# Altium project UZ_D_DSUB_Breakout.PrjPCB
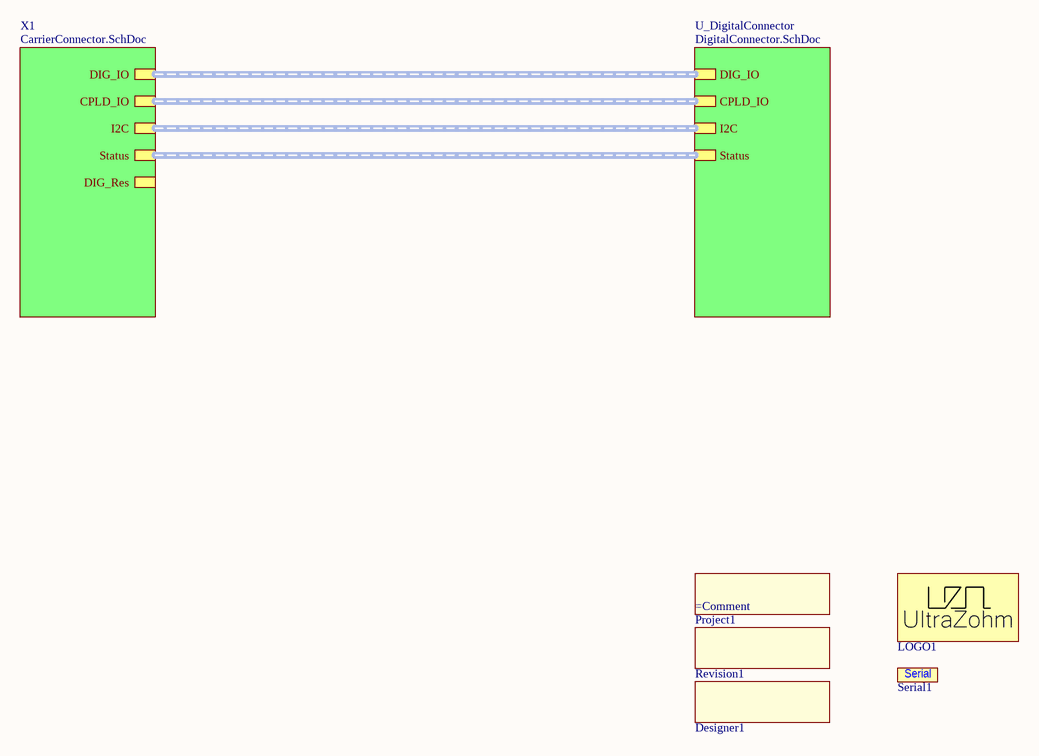
[diagram p0: TopSheet.SchDoc]
ProjectRevision: Rev01; ProjectNameCustom: =ProjectName; ProjectName: UZ_D_DSUB_Breakout; Date: 12/2022; AuthorParam: Andreas Geiger; Author: Andreas Geiger
3 sheets, 7 parts. Net scope: hierarchical (ports join the sheet entries above them; power ports are global).
Board file: UZ_D_DSUB_Breakout.PcbDoc
Sheets:
  TopSheet.SchDoc
    X1 = CarrierConnector.SchDoc
    U_DigitalConnector = DigitalConnector.SchDoc

## Sheet TopSheet.SchDoc
size A4; Author: Andreas Geiger; CompanyName: Technische Hochschule Nürnberg Georg Simon Ohm; Organization: UltraZohm; Address1: Kesslerplatz 12; Address2: 90489 Nürnberg; Address3: GERMANY; DocumentNumber: 1; SheetNumber: 1; SheetTotal: 3; Website: www.ultrazohm.com

### Parts
Designer1  (no value)  [Designator:comment]  (no BOM)
LOGO1  UZ Logo  [UZ_Logo_medium]  (value not drawn)  (no BOM)
Project1  (no value)  [COMMENT]  (no BOM)
Revision1  (no value)  [Designator:comment]  (no BOM)
Serial1  Serial #  [SERIAL]  (value not drawn)  (no BOM)

### Sub-sheets
U_DigitalConnector = DigitalConnector.SchDoc: I2C (harness DigCon_I2C), Status (harness DigCon_Status), CPLD_IO (harness DigCon_DCPLD_IO), DIG_IO (harness DigCon_DIG_IO)
X1 = CarrierConnector.SchDoc: DIG_IO (harness DigCon_DIG_IO), DIG_Res (harness DigCon_DIG_Res), CPLD_IO (harness DigCon_DCPLD_IO), Status (harness DigCon_Status), I2C (harness DigCon_I2C)

### Buses and harness runs
harness sheet U_DigitalConnector/CPLD_IO = sheet X1/CPLD_IO
harness sheet U_DigitalConnector/DIG_IO = sheet X1/DIG_IO
harness sheet U_DigitalConnector/I2C = sheet X1/I2C
harness sheet U_DigitalConnector/Status = sheet X1/Status

### Notes on the sheet
- Title
- Revision:
- Design Engineer:
- Date:
- Project:
- Sheet
- of
- (in symbol 6) Serial

### Library data of the parts
Designer1 = 4: Create a project parameter named "Author" this is the value of this component. It is printed on the PCB. Once the parameter is updated (e.g. new revision) it gets updated on the PCB as well; Manufacturer: PCB Manufacturer; Manufacturer Part Number: Project Author; Value: Andreas Geiger; Created from: T. Wendt; PartID: 4; Created On: 01.03.2021 08:53:41; Component Type: Project Author; Last Updated: 01.03.2021 09:20:27; Type: Standard (No BOM); Live Cycle Status: 1
LOGO1 = 1: Official Project Logo of the UltraZohm; Manufacturer: PCB Manufacturer; Manufacturer Part Number: UltraZohm Logo; Created from: T. Wendt; PartID: 1; Created On: 19.02.2021 16:55:56; ComponentLink1Description: Homepage; ComponentLink1URL: https://ultrazohm.com; Component Type: Logo; Last Updated: 02.03.2021 14:31:24; Type: Standard (No BOM); Live Cycle Status: 1
Project1 = 2: Create a project parameter named "ProjectNameCustom" this is the value of this component and it is printed on the PCB.; Manufacturer: PCB Manufacturer; Created from: T. Wendt; PartID: 2; Created On: 01.03.2021 08:43:57; Component Type: Project Name; Last Updated: 01.03.2021 09:07:27; Manufacturer Part Number: Project Name; Type: Standard (No BOM); Value: =ProjectName; Live Cycle Status: 1
Revision1 = 3: Create a project parameter named "ProjectRevision" this is the value of this component. It is printed on the PCB. Once the parameter is updated (e.g. new revision) it gets updated on the PCB as well; Manufacturer: PCB Manufacturer; Value: Rev01; Created from: T. Wendt; PartID: 3; Created On: 01.03.2021 08:50:34; Component Type: Project Revision; Last Updated: 01.03.2021 09:28:36; Manufacturer Part Number: Project Revision; Type: Standard (No BOM); Live Cycle Status: 1
Serial1 = 6: Field to put in a serial number; Manufacturer: PCB Manufacturer; Created from: T. Wendt; PartID: 6; Created On: 02.03.2021 14:31:24; Component Type: Serial Number; Last Updated: 02.03.2021 14:31:24; Manufacturer Part Number: Serial Number; Type: Standard (No BOM); Live Cycle Status: 1

## Sheet CarrierConnector.SchDoc
size A4; Author: Andreas Geiger; CompanyName: Technische Hochschule Nürnberg Georg Simon Ohm; Organization: UltraZohm; Address1: Kesslerplatz 12; Address2: 90489 Nürnberg; Address3: GERMANY; DocumentNumber: 2; SheetNumber: 1; SheetTotal: 2; Website: www.ultrazohm.com
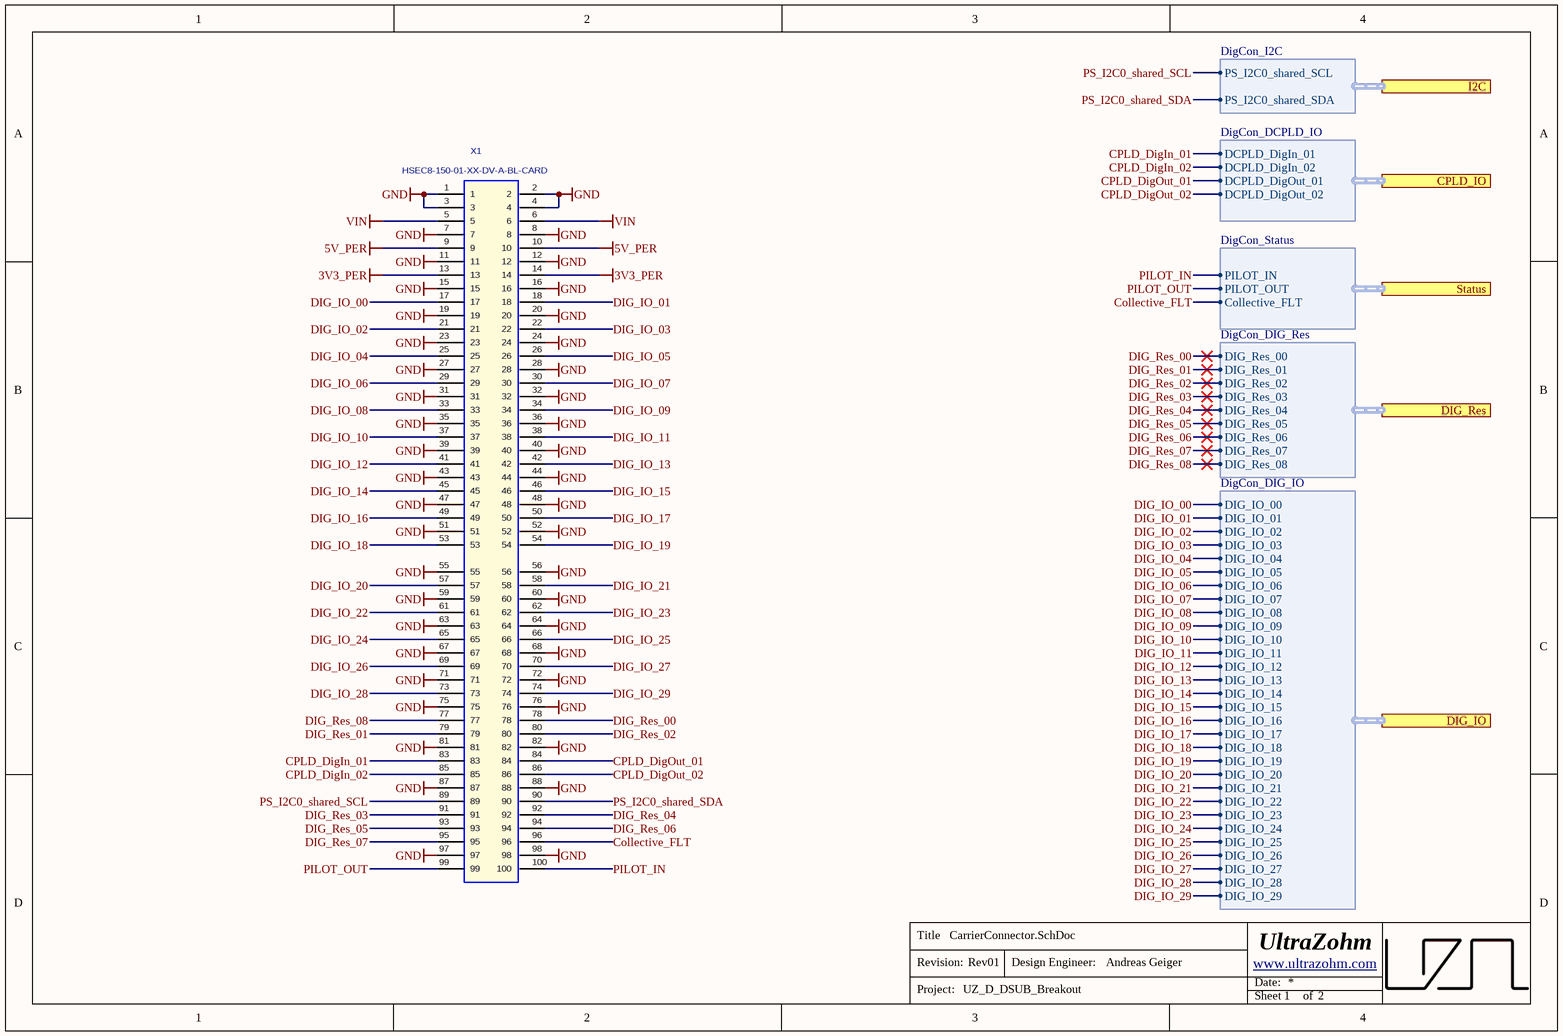
[diagram p1: CarrierConnector.SchDoc]

### Parts
X1  HSEC8-150-01-XX-DV-A-BL-CARD  [HSEC8-150-01-XX-DV-A-BL-CARD]  (no BOM)

### Ports
CPLD_IO (harness DigCon_DCPLD_IO, see TopSheet[2B], DigitalConnector[4A]), DIG_IO (harness DigCon_DIG_IO, see TopSheet[2A], DigitalConnector[4C]), DIG_Res (harness DigCon_DIG_Res, see TopSheet[2B]), I2C (harness DigCon_I2C, see TopSheet[2B], DigitalConnector[4A]), Status (harness DigCon_Status, see TopSheet[2B], DigitalConnector[4B])

### Harnesses
DigCon_I2C: PS_I2C0_shared_SDA, PS_I2C0_shared_SCL
DigCon_Status: PILOT_IN, PILOT_OUT, Collective_FLT
DigCon_DCPLD_IO: DCPLD_DigIn_01, DCPLD_DigIn_02, DCPLD_DigOut_01, DCPLD_DigOut_02
DigCon_DIG_IO: DIG_IO_01, DIG_IO_02, DIG_IO_03, DIG_IO_04, DIG_IO_05, DIG_IO_06, DIG_IO_07, DIG_IO_08, DIG_IO_09, DIG_IO_10, DIG_IO_11, DIG_IO_12, DIG_IO_13, DIG_IO_14, DIG_IO_15, DIG_IO_16, DIG_IO_17, DIG_IO_18, DIG_IO_19, DIG_IO_20, DIG_IO_21, DIG_IO_22, DIG_IO_23, DIG_IO_24, DIG_IO_25, DIG_IO_26, DIG_IO_27, DIG_IO_28, DIG_IO_29, DIG_IO_00
DigCon_DIG_Res: DIG_Res_01, DIG_Res_02, DIG_Res_03, DIG_Res_04, DIG_Res_05, DIG_Res_06, DIG_Res_07, DIG_Res_00, DIG_Res_08

### Nets
3V3_PER: X1.13 X1.14
5V_PER: X1.9 X1.10
GND: X1.1 X1.2 X1.3 X1.4 X1.7 X1.8 X1.11 X1.12 X1.15 X1.16 X1.19 X1.20 X1.23 X1.24 X1.27 X1.28 X1.31 X1.32 X1.35 X1.36 X1.39 X1.40 X1.43 X1.44 X1.47 X1.48 X1.51 X1.52 X1.55 X1.56 X1.59 X1.60 X1.63 X1.64 X1.67 X1.68 X1.71 X1.72 X1.75 X1.76 X1.81 X1.82 X1.87 X1.88 X1.97 X1.98
VIN: X1.5 X1.6
Collective_FLT: X1.96 ; port Status.Collective_FLT
CPLD_DigIn_01: X1.83 ; port CPLD_IO.DCPLD_DigIn_01
CPLD_DigIn_02: X1.85 ; port CPLD_IO.DCPLD_DigIn_02
CPLD_DigOut_01: X1.84 ; port CPLD_IO.DCPLD_DigOut_01
CPLD_DigOut_02: X1.86 ; port CPLD_IO.DCPLD_DigOut_02
DIG_IO_00: X1.17 ; port DIG_IO.DIG_IO_00
DIG_IO_01: X1.18 ; port DIG_IO.DIG_IO_01
DIG_IO_02: X1.21 ; port DIG_IO.DIG_IO_02
DIG_IO_03: X1.22 ; port DIG_IO.DIG_IO_03
DIG_IO_04: X1.25 ; port DIG_IO.DIG_IO_04
DIG_IO_05: X1.26 ; port DIG_IO.DIG_IO_05
DIG_IO_06: X1.29 ; port DIG_IO.DIG_IO_06
DIG_IO_07: X1.30 ; port DIG_IO.DIG_IO_07
DIG_IO_08: X1.33 ; port DIG_IO.DIG_IO_08
DIG_IO_09: X1.34 ; port DIG_IO.DIG_IO_09
DIG_IO_10: X1.37 ; port DIG_IO.DIG_IO_10
DIG_IO_11: X1.38 ; port DIG_IO.DIG_IO_11
DIG_IO_12: X1.41 ; port DIG_IO.DIG_IO_12
DIG_IO_13: X1.42 ; port DIG_IO.DIG_IO_13
DIG_IO_14: X1.45 ; port DIG_IO.DIG_IO_14
DIG_IO_15: X1.46 ; port DIG_IO.DIG_IO_15
DIG_IO_16: X1.49 ; port DIG_IO.DIG_IO_16
DIG_IO_17: X1.50 ; port DIG_IO.DIG_IO_17
DIG_IO_18: X1.53 ; port DIG_IO.DIG_IO_18
DIG_IO_19: X1.54 ; port DIG_IO.DIG_IO_19
DIG_IO_20: X1.57 ; port DIG_IO.DIG_IO_20
DIG_IO_21: X1.58 ; port DIG_IO.DIG_IO_21
DIG_IO_22: X1.61 ; port DIG_IO.DIG_IO_22
DIG_IO_23: X1.62 ; port DIG_IO.DIG_IO_23
DIG_IO_24: X1.65 ; port DIG_IO.DIG_IO_24
DIG_IO_25: X1.66 ; port DIG_IO.DIG_IO_25
DIG_IO_26: X1.69 ; port DIG_IO.DIG_IO_26
DIG_IO_27: X1.70 ; port DIG_IO.DIG_IO_27
DIG_IO_28: X1.73 ; port DIG_IO.DIG_IO_28
DIG_IO_29: X1.74 ; port DIG_IO.DIG_IO_29
DIG_Res_00: X1.78 ; port DIG_Res.DIG_Res_00
DIG_Res_01: X1.79 ; port DIG_Res.DIG_Res_01
DIG_Res_02: X1.80 ; port DIG_Res.DIG_Res_02
DIG_Res_03: X1.91 ; port DIG_Res.DIG_Res_03
DIG_Res_04: X1.92 ; port DIG_Res.DIG_Res_04
DIG_Res_05: X1.93 ; port DIG_Res.DIG_Res_05
DIG_Res_06: X1.94 ; port DIG_Res.DIG_Res_06
DIG_Res_07: X1.95 ; port DIG_Res.DIG_Res_07
DIG_Res_08: X1.77 ; port DIG_Res.DIG_Res_08
PILOT_IN: X1.100 ; port Status.PILOT_IN
PILOT_OUT: X1.99 ; port Status.PILOT_OUT
PS_I2C0_shared_SCL: X1.89 ; port I2C.PS_I2C0_shared_SCL
PS_I2C0_shared_SDA: X1.90 ; port I2C.PS_I2C0_shared_SDA

### Notes on the sheet
- Title
- Revision:
- Design Engineer:
- Date:
- Project:
- Sheet
- of

### Library data of the parts
X1 = HSEC8-150-01-XX-DV-A-BL-CARD: Mating Card Layout for HSEC8-150-01-XX-DV-A-BL; Manufacturer: SAMTEC; Created from: T. Wendt; Number of positions: 100; Created: 2018_04_23_AGeiger; Category: SAMTEC; Manufacturer Part Number: HSEC8-150-01-XX-DV-A-BL-CARD; PartID: 2; Created On: 26.02.2021 16:36:12; ComponentLink1Description: Homepage; ComponentLink1URL: https://www.samtec.com/products/hsec8-dp; Component Type: Board to Board Connector; Device Package: PCB Shape; Last Updated: 26.02.2021 16:37:20; Mounting Type: PCB Shape; Series: HSEC8; Supplier 1: SAMTEC; Supplier Part Number 1: NA; Type: Board to Board Connector; Live Cycle Status: 1; Stock number: not stored; Number of rows: 2

## Sheet DigitalConnector.SchDoc
size A4; Author: Andreas Geiger; CompanyName: Technische Hochschule Nürnberg Georg Simon Ohm; Organization: UltraZohm; Address1: Kesslerplatz 12; Address2: 90489 Nürnberg; Address3: GERMANY; DocumentNumber: 3; SheetNumber: 3; SheetTotal: 3; Website: www.ultrazohm.com
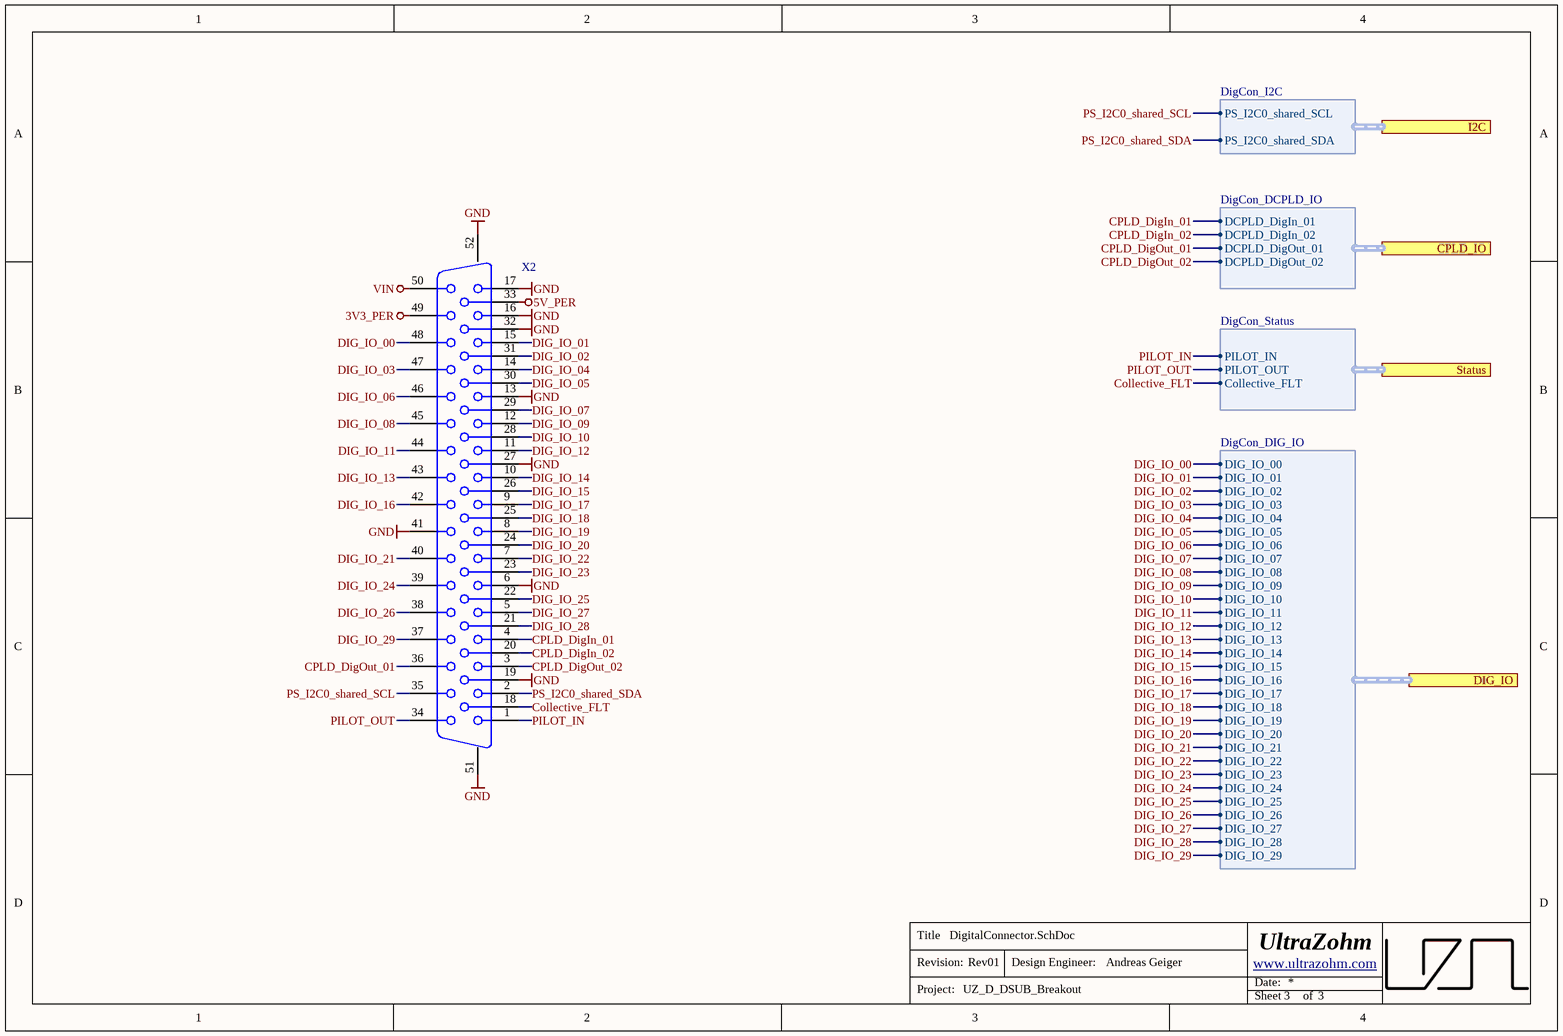
[diagram p2: DigitalConnector.SchDoc]

### Parts
X2  (no value)  [dsub50_female_164A18759X]

### Ports
CPLD_IO (harness DigCon_DCPLD_IO, see TopSheet[3B], CarrierConnector[4A]), DIG_IO (harness DigCon_DIG_IO, see TopSheet[3A], CarrierConnector[4C]), I2C (harness DigCon_I2C, see TopSheet[3B], CarrierConnector[4A]), Status (harness DigCon_Status, see TopSheet[3B], CarrierConnector[4B])

### Harnesses
DigCon_Status: PILOT_IN, PILOT_OUT, Collective_FLT
DigCon_DCPLD_IO: DCPLD_DigIn_01, DCPLD_DigIn_02, DCPLD_DigOut_01, DCPLD_DigOut_02
DigCon_DIG_IO: DIG_IO_01, DIG_IO_02, DIG_IO_03, DIG_IO_04, DIG_IO_05, DIG_IO_06, DIG_IO_07, DIG_IO_08, DIG_IO_09, DIG_IO_10, DIG_IO_11, DIG_IO_12, DIG_IO_13, DIG_IO_14, DIG_IO_15, DIG_IO_16, DIG_IO_17, DIG_IO_18, DIG_IO_19, DIG_IO_20, DIG_IO_21, DIG_IO_22, DIG_IO_23, DIG_IO_24, DIG_IO_25, DIG_IO_26, DIG_IO_27, DIG_IO_28, DIG_IO_29, DIG_IO_00
DigCon_I2C: PS_I2C0_shared_SDA, PS_I2C0_shared_SCL

### Nets
3V3_PER: X2.49
5V_PER: X2.33
GND: X2.6 X2.13 X2.16 X2.17 X2.19 X2.27 X2.32 X2.41 X2.51 X2.52
VIN: X2.50
Collective_FLT: X2.18 ; port Status.Collective_FLT
CPLD_DigIn_01: X2.4 ; port CPLD_IO.DCPLD_DigIn_01
CPLD_DigIn_02: X2.20 ; port CPLD_IO.DCPLD_DigIn_02
CPLD_DigOut_01: X2.36 ; port CPLD_IO.DCPLD_DigOut_01
CPLD_DigOut_02: X2.3 ; port CPLD_IO.DCPLD_DigOut_02
DIG_IO_00: X2.48 ; port DIG_IO.DIG_IO_00
DIG_IO_01: X2.15 ; port DIG_IO.DIG_IO_01
DIG_IO_02: X2.31 ; port DIG_IO.DIG_IO_02
DIG_IO_03: X2.47 ; port DIG_IO.DIG_IO_03
DIG_IO_04: X2.14 ; port DIG_IO.DIG_IO_04
DIG_IO_05: X2.30 ; port DIG_IO.DIG_IO_05
DIG_IO_06: X2.46 ; port DIG_IO.DIG_IO_06
DIG_IO_07: X2.29 ; port DIG_IO.DIG_IO_07
DIG_IO_08: X2.45 ; port DIG_IO.DIG_IO_08
DIG_IO_09: X2.12 ; port DIG_IO.DIG_IO_09
DIG_IO_10: X2.28 ; port DIG_IO.DIG_IO_10
DIG_IO_11: X2.44 ; port DIG_IO.DIG_IO_11
DIG_IO_12: X2.11 ; port DIG_IO.DIG_IO_12
DIG_IO_13: X2.43 ; port DIG_IO.DIG_IO_13
DIG_IO_14: X2.10 ; port DIG_IO.DIG_IO_14
DIG_IO_15: X2.26 ; port DIG_IO.DIG_IO_15
DIG_IO_16: X2.42 ; port DIG_IO.DIG_IO_16
DIG_IO_17: X2.9 ; port DIG_IO.DIG_IO_17
DIG_IO_18: X2.25 ; port DIG_IO.DIG_IO_18
DIG_IO_19: X2.8 ; port DIG_IO.DIG_IO_19
DIG_IO_20: X2.24 ; port DIG_IO.DIG_IO_20
DIG_IO_21: X2.40 ; port DIG_IO.DIG_IO_21
DIG_IO_22: X2.7 ; port DIG_IO.DIG_IO_22
DIG_IO_23: X2.23 ; port DIG_IO.DIG_IO_23
DIG_IO_24: X2.39 ; port DIG_IO.DIG_IO_24
DIG_IO_25: X2.22 ; port DIG_IO.DIG_IO_25
DIG_IO_26: X2.38 ; port DIG_IO.DIG_IO_26
DIG_IO_27: X2.5 ; port DIG_IO.DIG_IO_27
DIG_IO_28: X2.21 ; port DIG_IO.DIG_IO_28
DIG_IO_29: X2.37 ; port DIG_IO.DIG_IO_29
PILOT_IN: X2.1 ; port Status.PILOT_IN
PILOT_OUT: X2.34 ; port Status.PILOT_OUT
PS_I2C0_shared_SCL: X2.35 ; port I2C.PS_I2C0_shared_SCL
PS_I2C0_shared_SDA: X2.2 ; port I2C.PS_I2C0_shared_SDA

### Notes on the sheet
- Title
- Revision:
- Design Engineer:
- Date:
- Project:
- Sheet
- of

### Library data of the parts
X2 = 164A18759X: D-Sub Standard Connectors DSUB SOLDER PIN ANG 9.4mm; MF: CONEC; Created from: AGeiger; MPN: 164A18759X; Value: 164A18759X; Supplier Part Number 1: D-SUB BU 50GWC; ComponentLink1Description: Datasheet; ComponentLink1URL: https://conec.com/catalog/pub/media/conec/drawings/164A18759X.pdf; Supplier Part Number 2: 706-164A18759X; Supplier 1: Reichelt; Supplier 2: Mouser; Supplier 3: Digi-Key; Supplier Part Number 3: 164A18759X-ND; Created: 2019_10_24_AGeiger; Manufacturer Part Number: 164A18759X; PartID: 2; Created On: 22.12.2022 17:03:01; Last Updated: 22.12.2022 17:05:07; Manufacturer: CONEC; Mounting Type: THT; Operating Temperature: -55 °C to +125 °C; Series: D-SUB Standard

## Nets that join several sheets
3V3_PER: CarrierConnector (X1.13 X1.14), DigitalConnector (X2.49)
5V_PER: CarrierConnector (X1.9 X1.10), DigitalConnector (X2.33)
GND: CarrierConnector (46 pins), DigitalConnector (10 pins)
VIN: CarrierConnector (X1.5 X1.6), DigitalConnector (X2.50)
Collective_FLT: CarrierConnector (X1.96), DigitalConnector (X2.18)
CPLD_DigIn_01: CarrierConnector (X1.83), DigitalConnector (X2.4)
CPLD_DigIn_02: CarrierConnector (X1.85), DigitalConnector (X2.20)
CPLD_DigOut_01: CarrierConnector (X1.84), DigitalConnector (X2.36)
CPLD_DigOut_02: CarrierConnector (X1.86), DigitalConnector (X2.3)
DIG_IO_00: CarrierConnector (X1.17), DigitalConnector (X2.48)
DIG_IO_01: CarrierConnector (X1.18), DigitalConnector (X2.15)
DIG_IO_02: CarrierConnector (X1.21), DigitalConnector (X2.31)
DIG_IO_03: CarrierConnector (X1.22), DigitalConnector (X2.47)
DIG_IO_04: CarrierConnector (X1.25), DigitalConnector (X2.14)
DIG_IO_05: CarrierConnector (X1.26), DigitalConnector (X2.30)
DIG_IO_06: CarrierConnector (X1.29), DigitalConnector (X2.46)
DIG_IO_07: CarrierConnector (X1.30), DigitalConnector (X2.29)
DIG_IO_08: CarrierConnector (X1.33), DigitalConnector (X2.45)
DIG_IO_09: CarrierConnector (X1.34), DigitalConnector (X2.12)
DIG_IO_10: CarrierConnector (X1.37), DigitalConnector (X2.28)
DIG_IO_11: CarrierConnector (X1.38), DigitalConnector (X2.44)
DIG_IO_12: CarrierConnector (X1.41), DigitalConnector (X2.11)
DIG_IO_13: CarrierConnector (X1.42), DigitalConnector (X2.43)
DIG_IO_14: CarrierConnector (X1.45), DigitalConnector (X2.10)
DIG_IO_15: CarrierConnector (X1.46), DigitalConnector (X2.26)
DIG_IO_16: CarrierConnector (X1.49), DigitalConnector (X2.42)
DIG_IO_17: CarrierConnector (X1.50), DigitalConnector (X2.9)
DIG_IO_18: CarrierConnector (X1.53), DigitalConnector (X2.25)
DIG_IO_19: CarrierConnector (X1.54), DigitalConnector (X2.8)
DIG_IO_20: CarrierConnector (X1.57), DigitalConnector (X2.24)
DIG_IO_21: CarrierConnector (X1.58), DigitalConnector (X2.40)
DIG_IO_22: CarrierConnector (X1.61), DigitalConnector (X2.7)
DIG_IO_23: CarrierConnector (X1.62), DigitalConnector (X2.23)
DIG_IO_24: CarrierConnector (X1.65), DigitalConnector (X2.39)
DIG_IO_25: CarrierConnector (X1.66), DigitalConnector (X2.22)
DIG_IO_26: CarrierConnector (X1.69), DigitalConnector (X2.38)
DIG_IO_27: CarrierConnector (X1.70), DigitalConnector (X2.5)
DIG_IO_28: CarrierConnector (X1.73), DigitalConnector (X2.21)
DIG_IO_29: CarrierConnector (X1.74), DigitalConnector (X2.37)
PILOT_IN: CarrierConnector (X1.100), DigitalConnector (X2.1)
PILOT_OUT: CarrierConnector (X1.99), DigitalConnector (X2.34)
PS_I2C0_shared_SCL: CarrierConnector (X1.89), DigitalConnector (X2.35)
PS_I2C0_shared_SDA: CarrierConnector (X1.90), DigitalConnector (X2.2)